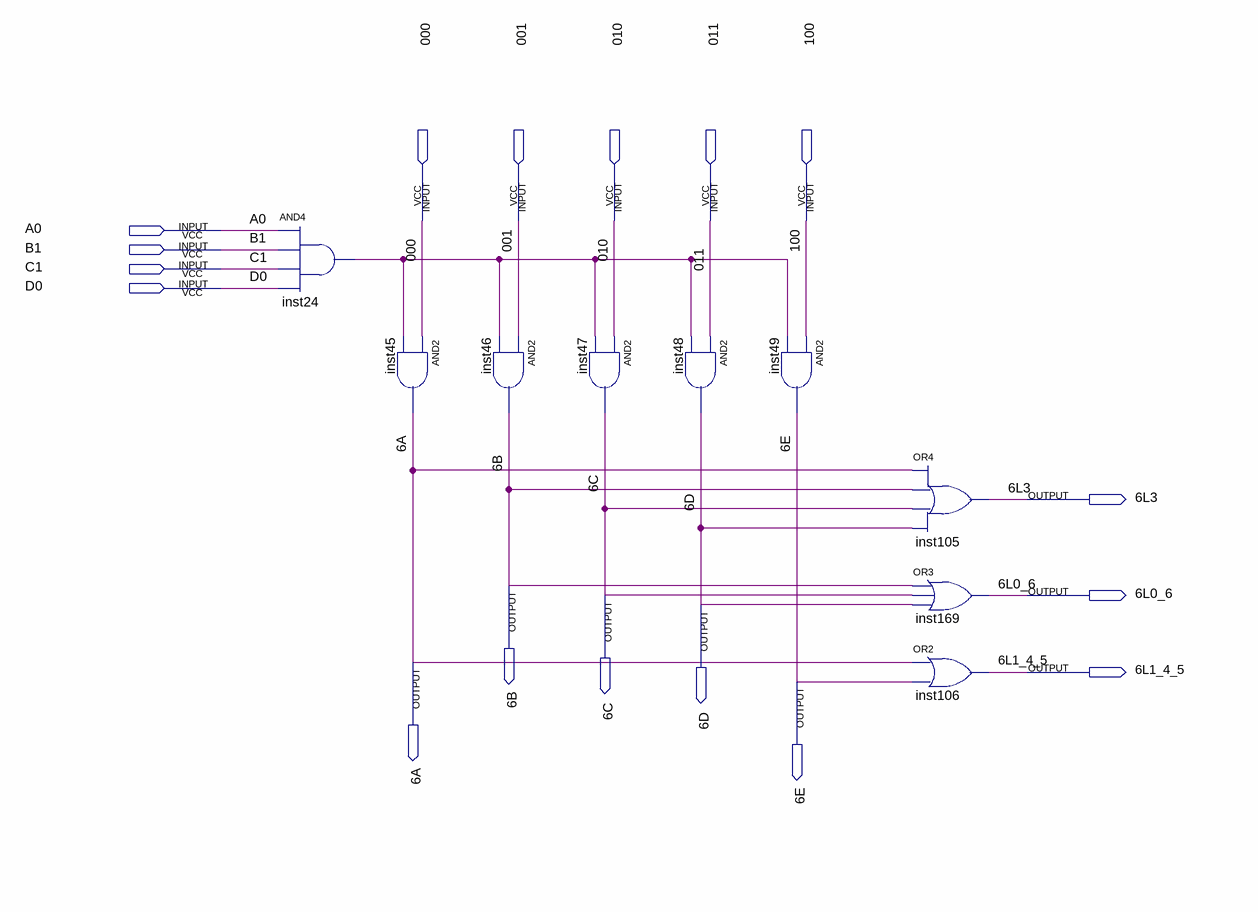
[diagram p0: schematic sheet]
// Quartus schematic carac6.bdf as structural Verilog: 9 symbols, 17 pins
module carac6 (
  input  \000 ,
  input  \001 ,
  input  \010 ,
  input  \011 ,
  input  \100 ,
  input  A0,
  input  B1,
  input  C1,
  input  D0,
  output \6L3 ,
  output \6B ,
  output \6C ,
  output \6L0_6 ,
  output \6D ,
  output \6A ,
  output \6L1_4_5 ,
  output \6E 
);

  wire inst24_out;

  and inst24 (inst24_out, A0, B1, C1, D0);
  and inst45 (\6A , \000 , inst24_out);
  and inst46 (\6B , \001 , inst24_out);
  and inst47 (\6C , \010 , inst24_out);
  and inst48 (\6D , \011 , inst24_out);
  and inst49 (\6E , \100 , inst24_out);
  or inst105 (\6L3 , \6A , \6B , \6C , \6D );
  or inst169 (\6L0_6 , \6B , \6C , \6D );
  or inst106 (\6L1_4_5 , \6A , \6E );
endmodule
